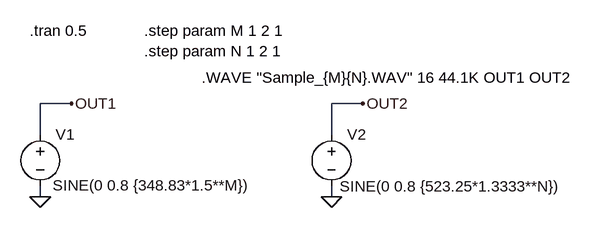
[diagram p0: schematic Fig_9-21_SOUND_Param-MN.asc]
Fig_9-21_SOUND_Param-MN.asc, the LTspice schematic file:
Version 4
SHEET 1 1052 680
WIRE 160 224 112 224
WIRE 608 224 560 224
WIRE 112 272 112 224
WIRE 560 272 560 224
WIRE 112 368 112 352
WIRE 560 368 560 352
FLAG 112 368 0
FLAG 160 224 OUT1
FLAG 560 368 0
FLAG 608 224 OUT2
SYMBOL voltage 112 256 R0
WINDOW 123 0 0 Left 0
WINDOW 39 0 0 Left 0
WINDOW 3 19 94 Left 2
SYMATTR Value SINE(0 0.8 {348.83*1.5**M})
SYMATTR InstName V1
SYMBOL voltage 560 256 R0
WINDOW 123 0 0 Left 0
WINDOW 39 0 0 Left 0
WINDOW 3 13 96 Left 2
SYMATTR Value SINE(0 0.8 {523.25*1.3333**N})
SYMATTR InstName V2
TEXT 360 184 Left 2 !.WAVE "Sample_{M}{N}.WAV" 16 44.1K OUT1 OUT2
TEXT 96 112 Left 2 !.tran 0.5
TEXT 272 112 Left 2 !.step param M 1 2 1\n.step param N 1 2 1

The netlist it stands for:
* Fig_9-21_SOUND_Param-MN.asc
V1 OUT1 0 SINE(0 0.8 {348.83*1.5**M})
V2 OUT2 0 SINE(0 0.8 {523.25*1.3333**N})
.WAVE "Sample_{M}{N}.WAV" 16 44.1K OUT1 OUT2
.tran 0.5
.step param M 1 2 1
.step param N 1 2 1
.backanno
.end